# Altium schematic sheet PowerManager.SchDoc
size A4
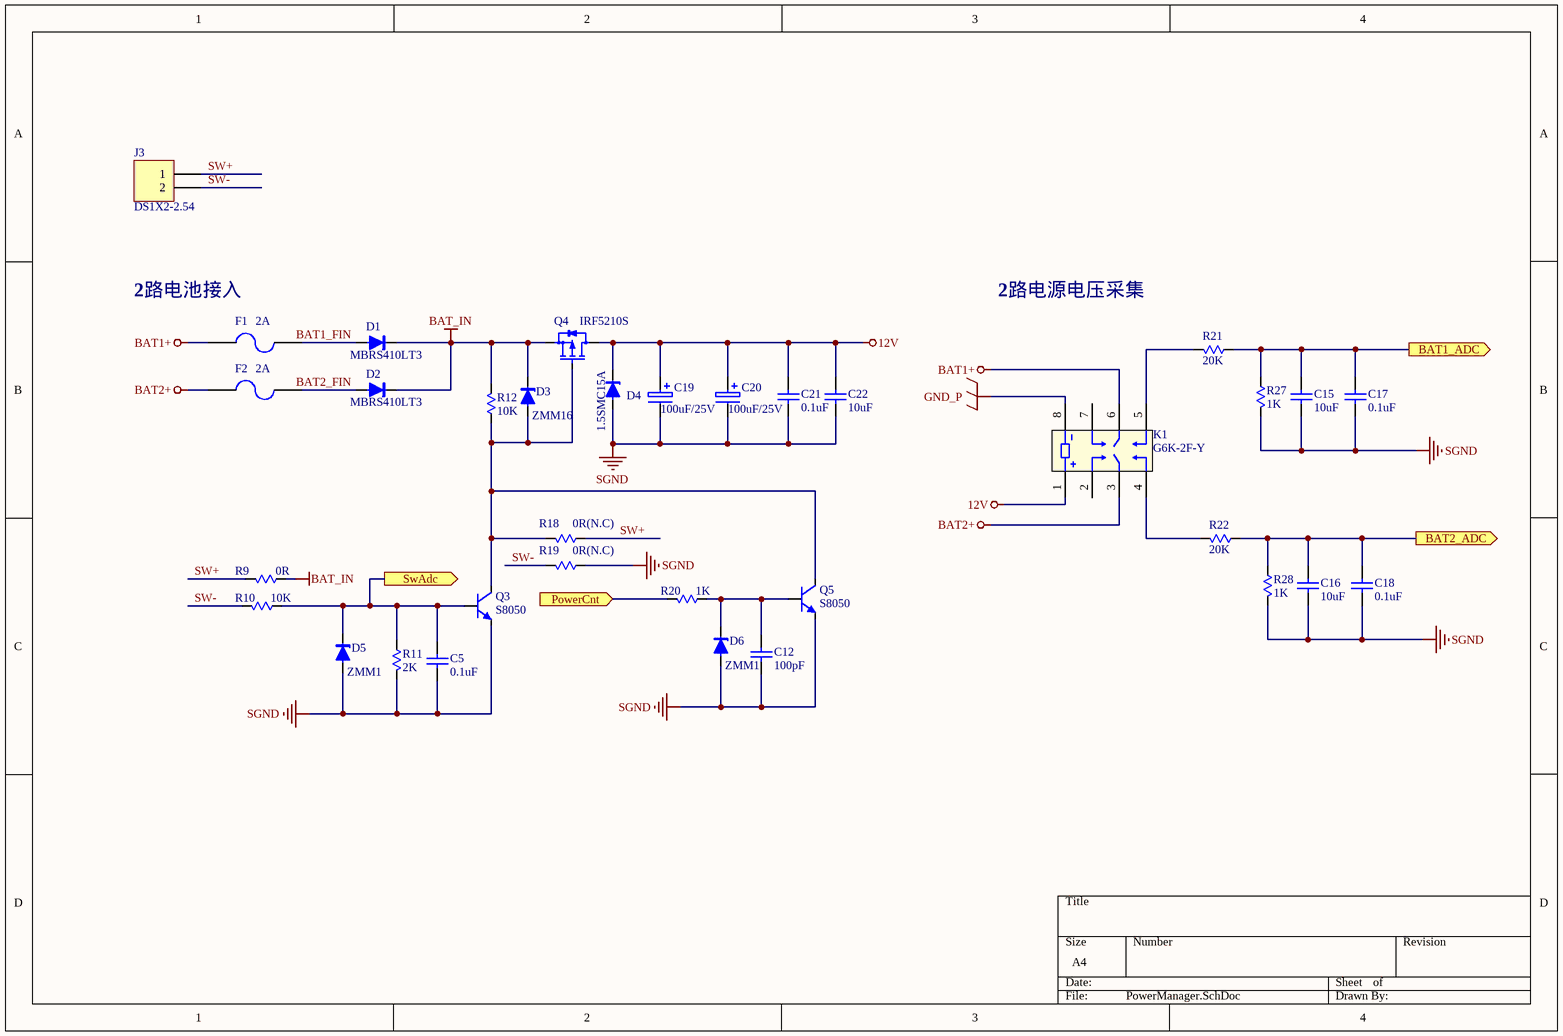
[diagram p0: PowerManager.SchDoc]

## Parts
C5  0.1uF  [C0805]
C12  100pF  [C0805]
C15  10uF  [C0805]
C16  10uF  [C0805]
C17  0.1uF  [C0805]
C18  0.1uF  [C0805]
C19  100uF/25V  [CT7343-E-S]
C20  100uF/25V  [CT7343-E-S]
C21  0.1uF  [C0805]
C22  10uF  [C0805]
D1  MBRS410LT3  [SMC]
D2  MBRS410LT3  [SMC]
D3  ZMM16  [SOD-80]
D4  1.5SMC15A  [SMC]
D5  ZMM1  [SOD-80]
D6  ZMM1  [SOD-80]
F1  2A  [F1812]
F2  2A  [F1812]
J3  DS1X2-2.54  [ZH1X2WT-1.5]
K1  G6K-2F-Y  [G6K-2F-Y]
Q3  S8050  [SOT-23]
Q4  IRF5210S  [TO-262]
Q5  S8050  [SOT-23]
R9  0R  [R0805]
R10  10K  [R0805]
R11  2K  [R0805]
R12  10K  [R0805]
R18  0R(N.C)  [R0805]
R19  0R(N.C)  [R0805]
R20  1K  [R0805]
R21  20K  [R0805]
R22  20K  [R0805]
R27  1K  [R0805]
R28  1K  [R0805]

## Ports
BAT1_ADC (out), BAT2_ADC (out), PowerCnt (in), SwAdc (out)

## Nets
12V: C19.1 C20.1 C21.2 C22.2 D4.2(K) K1.1 Q4.2(D)
BAT1+: F1.1 K1.6
BAT2+: F2.1 K1.3
BAT_IN: D1.2(K) D2.2(K) D3.2(K) Q4.3(S) R9.2 R12.1
GND_P: K1.8
SGND: C5.1 C12.1 C15.2 C16.2 C17.2 C18.2 C19.2 C20.2 C21.1 C22.1 D4.1(A) D5.1(A) D6.1(A) Q3.2(E) Q5.2(E) R11.1 R19.1 R27.1 R28.1
BAT1_ADC: C15.1 C17.1 R21.2 R27.2 ; port BAT1_ADC
BAT2_ADC: C16.1 C18.1 R22.2 R28.2 ; port BAT2_ADC
PowerCnt: R20.1 ; port PowerCnt
SW+: J3.1 R9.1 R18.1
SW-: J3.2 R10.1 R19.2
SwAdc: C5.2 D5.2(K) Q3.1(B) R10.2 R11.2 ; port SwAdc
NetC12_2: C12.2 D6.2(K) Q5.1(B) R20.2
NetD1_1: D1.1(A) F1.2
NetD2_1: D2.1(A) F2.2
NetD3_1: D3.1(A) Q3.3(C) Q4.1(G) Q5.3(C) R12.2 R18.2
NetK1_4: K1.4 R22.1
NetK1_5: K1.5 R21.1

Not connected (* = marked no-connect by the designer): K1 2 7

## Notes on the sheet
- 2路电池接入
- 2路电源电压采集
- Labels drawn without touching a wire or pin: BAT1_FIN, BAT2_FIN

## Library data of the parts
C5 C12 C21 C22 = Cap: Capacitor; Value: 22pF; Published: 8-Jun-2000; Revision: July-2002: Re-released for DXP Platform.; Publisher: Altium Limited
C15-C18 = CAP: Published: 8-Jun-2000; LatestRevisionDate: 17-Jul-2002; LatestRevisionNote: Re-released for DXP Platform.; PackageReference: RAD-0.3; Publisher: Altium Limited
  C15 C16: Value: 10uF
  C17 C18: Value: 0.1uF
C19 C20 = ELECTRO: Electrolytic Capacitor
D1-D6 = DIODE-ZENER: Small Signal Zener Diodes
F1 F2 = FUSE2: Fuse
J3 = Header 2: Header, 2-Pin; LatestRevisionDate: 17-Jul-2002; LatestRevisionNote: Re-released for DXP Platform.; Publisher: Altium Limited
Q3 Q5 = NPN: NPN General Purpose Amplifier; Published: 8-Jun-2000; LatestRevisionDate: 15-Jan-2003; LatestRevisionNote: PCB Footprint 'BCY-W3/D4.7' replaced; DatasheetDocument: 1997; PackageDocument: Sep-1998; PackageReference: TO-92A; Publisher: Altium Limited; Code_JEDEC: TO-92A; ComponentLink1Description: Manufacturer Link; ComponentLink1URL: http://www.fairchildsemi.com/; ComponentLink2Description: Datasheet; ComponentLink2URL: http://www.fairchildsemi.com/ds/2N%2F2N3904.pdf
Q4 = PMOS: P-Channel 30-V (D-S), 150 C MOSFET
R9-R12 R20 = Res: Resistor; Published: 8-Jun-2000; LatestRevisionDate: 04-Mar-2005; LatestRevisionNote: PCB Footprint replaced.; PackageReference: J1-0603; Publisher: Altium Limited
  R9: Value: 0R
  R10 R12: Value: 10K
  R11: Value: 2K
  R20: Value: 1K
R18 R19 R21 R22 R27 R28 = RES: Resistor; Published: 8-Jun-2000; LatestRevisionDate: 17-Jul-2002; LatestRevisionNote: Re-released for DXP Platform.; PackageReference: AXIAL-0.3; Publisher: Altium Limited
  R18 R19: Value: 0R(N.C)
  R21 R22: Value: 20K
  R27 R28: Value: 1K